# Altium schematic sheet HV_BUCK.SchDoc (part 1 of 2)
size A; SheetNumber: 2; SheetTotal: 3
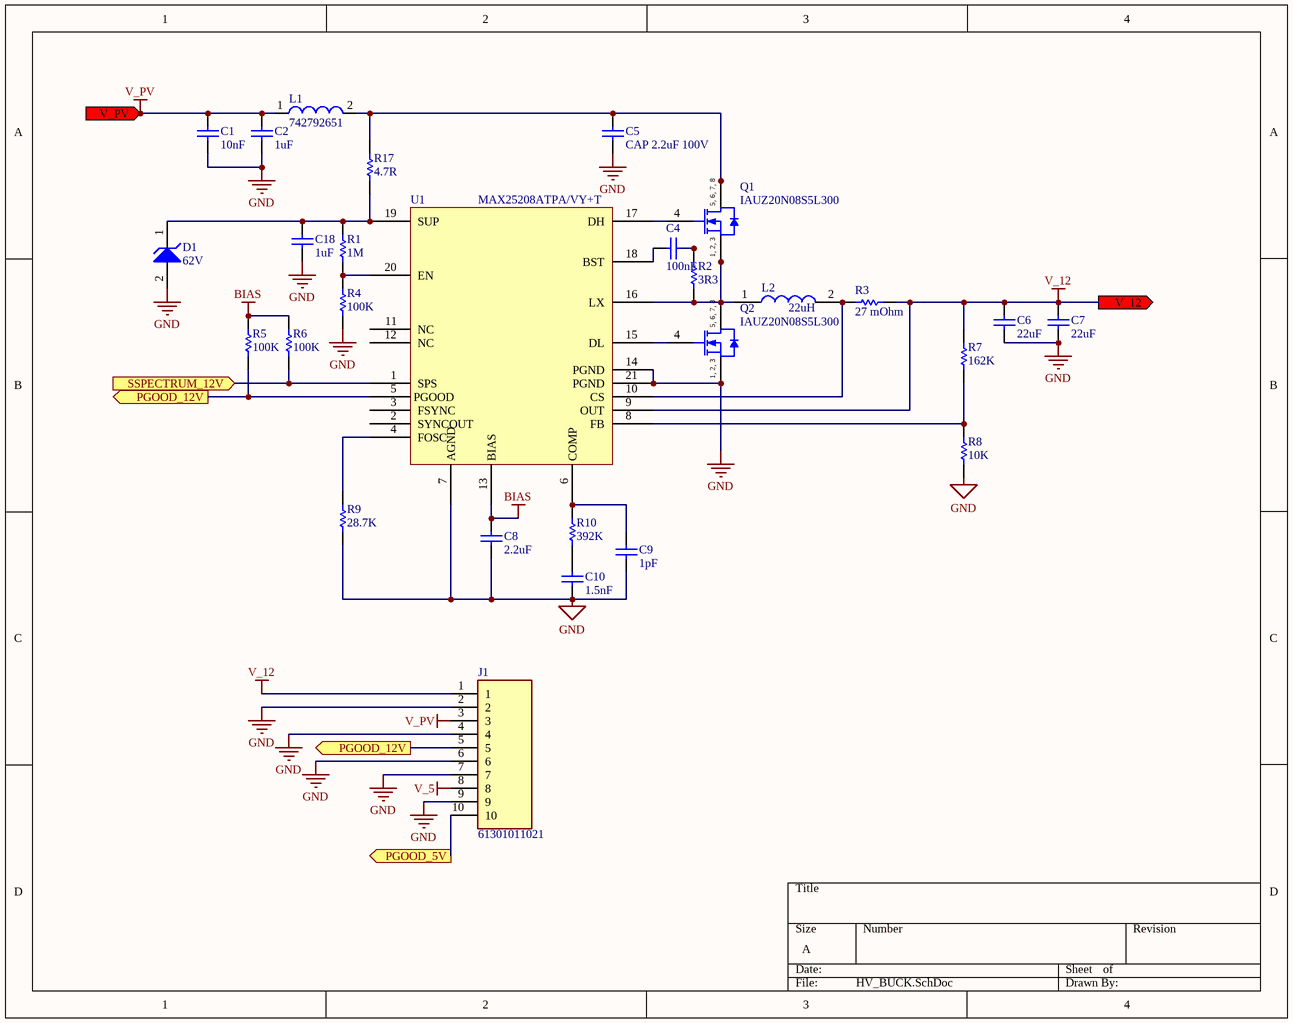
[diagram p0: HV_BUCK.SchDoc]

## Parts
C1  10nF  [CAPC2013X94X50ML20T25]
C2  1uF  [CAPC3216X180X50NL20T25]
C4  100nF  [CAPC1005X56X25NL10T15]
C5  CAP 2.2uF 100V  [CAPC1210(3225)280_N]
C6  22uF  [CAPC3225X279X50NL20T25]
C7  22uF  [CAPC3225X279X50NL20T25]
C8  2.2uF  [CAPC2013X135X50ML10T20]
C9  1pF  [CAPC1005X55X25NL05T05]
C10  1.5nF  [CAPC1005X55X25ML05T10]
C18  1uF  [CAPC2013X145X20NL20]
D1  62V  [ONSC-SOD-123-2-425-04_V]
J1  61301011021  [HDRRA10W64P0X254_1X10_2540X254X254P]
L1  742792651  [SMD-0603]
L2  22uH  [INDPM8680X400N]
Q1  IAUZ20N08S5L300  [INF-PG-TSDSON-8-1_V]
Q2  IAUZ20N08S5L300  [INF-PG-TSDSON-8-1_V]
R1  1M  [RESC1608X55X25NL10T15]
R2  3R3  [RESC1005X40X25NL05T10]
R3  27 mOhm  [RESC3116X65X40NL10T20]
R4  100K  [RESC1608X55X25NL10T15]
R5  100K  [RESC1005X40X25NL05T10]
R6  100K  [RESC1005X40X25NL05T10]
R7  162K  [RESC1005X40X25NL05T10]
R8  10K  [RESC1005X40X25NL05T10]
R9  28.7K  [RESC1005X40X25NL05T05]
R10  392K  [RESC1005X40X25NL05T10]
R17  4.7R  [RESC2013X70X40NL20T20]
U1  Supplier Part Number 1: MAX25208ATPA/VY+T  [QFN50P400X400X80_HS-21N]  (hidden comment: MAX25208)

## Ports
PGOOD_5V (out), PGOOD_12V (out), SSPECTRUM_12V (in), V_12 (out), V_PV (in)

## Nets
BIAS: C8.2 R5.1 R6.1 U1.13(BIAS)
GND: C1.1 C2.1 C5.1 C6.1 C7.1 C8.1 C9.1 C10.1 C18.1 D1.2(A) J1.2 J1.4 J1.6 J1.7 J1.9 Q2.1(SOURCE) Q2.2(SOURCE) Q2.3(SOURCE) R4.1 R8.1 R9.1 U1.7(AGND) U1.14(PGND) U1.21(PGND)
V_5: J1.8
V_12: C6.2 C7.2 J1.1 R3.2 R7.2 U1.9(OUT) ; port V_12
V_PV: C1.2 C2.2 J1.3 L1.1 ; port V_PV
PGOOD_5V: J1.10 ; port PGOOD_5V
PGOOD_12V: J1.5 R5.2 U1.5(PGOOD) ; port PGOOD_12V
SSPECTRUM_12V: R6.2 U1.1(SPS) ; port SSPECTRUM_12V
NetC4_1: C4.1 U1.18(BST)
NetC4_2: C4.2 R2.2
NetC5_2: C5.2 L1.2 Q1.5(DRAIN) Q1.6(DRAIN) Q1.7(DRAIN) Q1.8(DRAIN) R17.2
NetC9_2: C9.2 R10.2 U1.6(COMP)
NetC10_2: C10.2 R10.1
NetC18_2: C18.2 D1.1(K) R1.2 R17.1 U1.19(SUP)
NetL2_1: L2.1 Q1.1(SOURCE) Q1.2(SOURCE) Q1.3(SOURCE) Q2.5(DRAIN) Q2.6(DRAIN) Q2.7(DRAIN) Q2.8(DRAIN) R2.1 U1.16(LX)
NetL2_2: L2.2 R3.1 U1.10(CS)
NetQ1_4: Q1.4(GATE) U1.17(DH)
NetQ2_4: Q2.4(GATE) U1.15(DL)
NetR1_1: R1.1 R4.2 U1.20(EN)
NetR7_1: R7.1 R8.2 U1.8(FB)
NetR9_2: R9.2 U1.4(FOSC)

Not connected (* = marked no-connect by the designer): U1 2(SYNCOUT) 3(FSYNC) 11(NC) 12(NC)